# Altium schematic sheet Memory.SchDoc: SRAM & FLASH & SDRAM
size A4; DocumentNumber: MB1246; Revision: B.1; SheetNumber: 4; SheetTotal: 17; Project: STM32H7xxI-EVAL
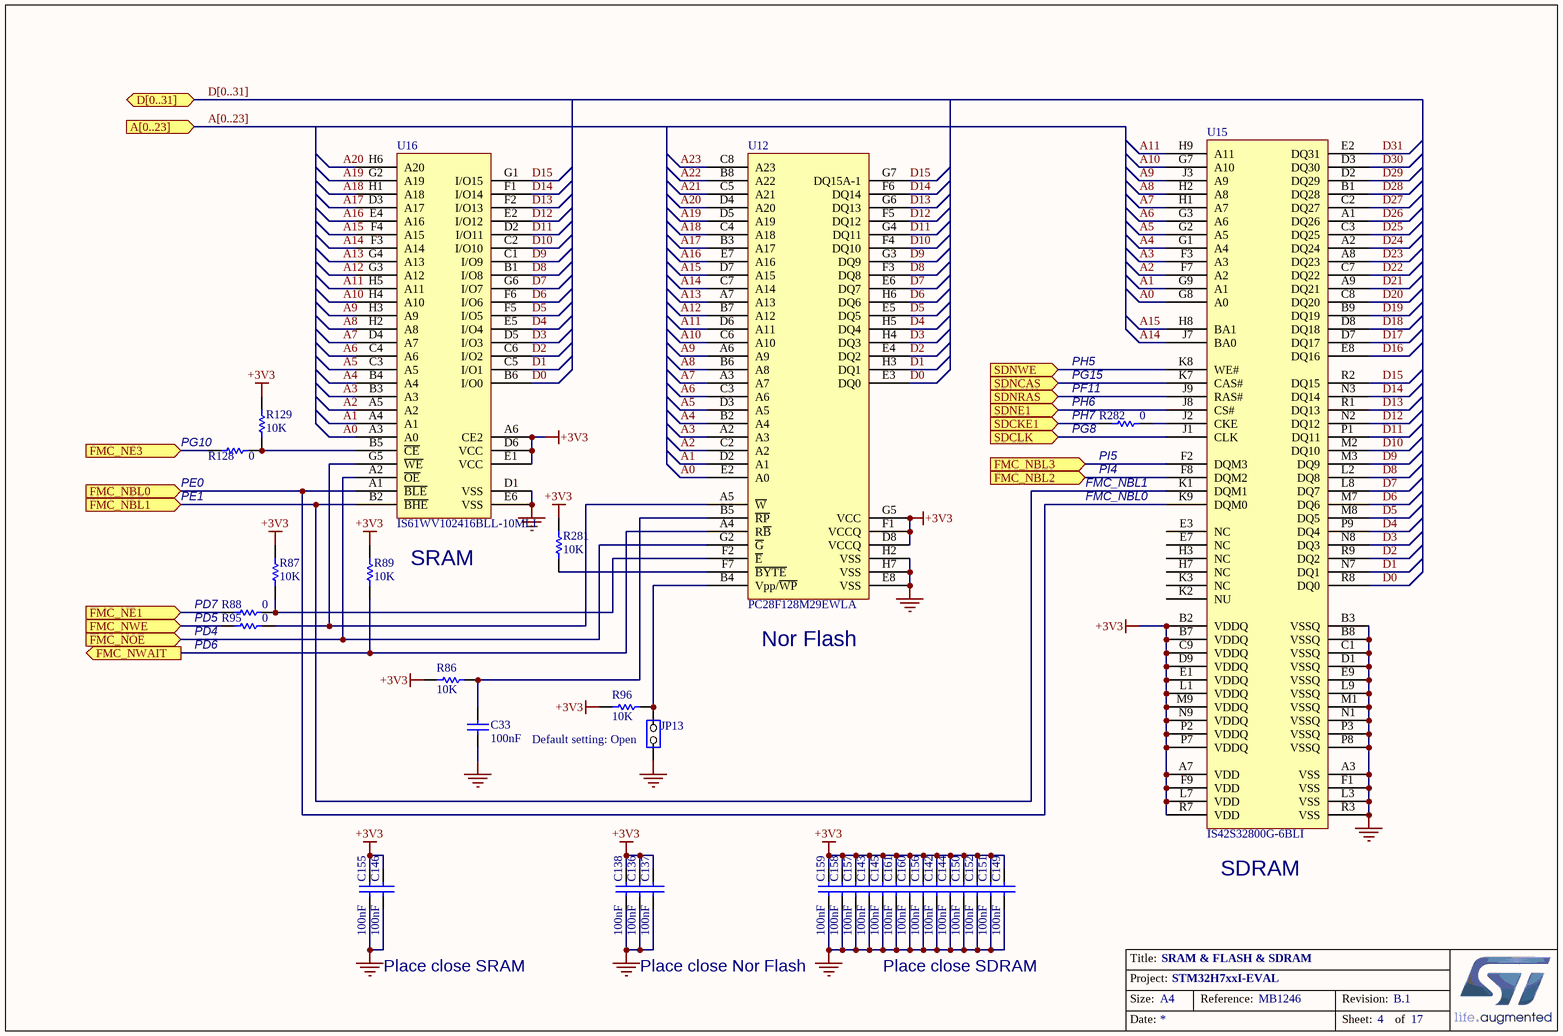
[diagram p0: Memory.SchDoc]

## Parts
C33  100nF  [0603C]
C136  100nF  [0603C]
C137  100nF  [0603C]
C138  100nF  [0603C]
C142  100nF  [0603C]
C143  100nF  [0603C]
C144  100nF  [0603C]
C145  100nF  [0603C]
C146  100nF  [0603C]
C149  100nF  [0603C]
C150  100nF  [0603C]
C151  100nF  [0603C]
C152  100nF  [0603C]
C155  100nF  [0603C]
C156  100nF  [0603C]
C157  100nF  [0603C]
C158  100nF  [0603C]
C159  100nF  [0603C]
C160  100nF  [0603C]
C161  100nF  [0603C]
JP13  (no value)  [SIP2]
R86  10K  [0603R]
R87  10K  [0603R]
R88  0  [0603R]
R89  10K  [0603R]
R95  0  [0603R]
R96  10K  [0603R]
R128  0  [0603R]
R129  10K  [0603R]
R281  10K  [0603R]
R282  0  [0603R]
U12  PC28F128M29EWLA  [FBGA64_1_11X13]
U15  IS42S32800G-6BLI  [FBGA90_0R8_8X13]
U16  IS61WV102416BLL-10MLI  [BGA48_0R75_9X11]

## Ports
A[0..23] (in), D[0..31] (bidir), FMC_NBL0 (in), FMC_NBL1 (in), FMC_NBL2 (in), FMC_NBL3 (in), FMC_NE1 (in), FMC_NE3 (in), FMC_NOE (in), FMC_NWAIT (out), FMC_NWE (in), SDCKE1 (in), SDCLK (in), SDNCAS (in), SDNE1 (in), SDNRAS (in), SDNWE (in)

## Nets
+3V3: C136.1 C137.1 C138.1 C142.1 C143.1 C144.1 C145.1 C146.1 C149.1 C150.1 C151.1 C152.1 C155.1 C156.1 C157.1 C158.1 C159.1 C160.1 C161.1 R86.1 R87.2 R89.2 R96.2 R129.2 R281.2 U12.D8(VCCQ) U12.F1(VCCQ) U12.G5(VCC) U15.A7(VDD) U15.B2(VDDQ) U15.B7(VDDQ) U15.C9(VDDQ) U15.D9(VDDQ) U15.E1(VDDQ) U15.F9(VDD) U15.L1(VDDQ) U15.L7(VDD) U15.M9(VDDQ) U15.N9(VDDQ) U15.P2(VDDQ) U15.P7(VDDQ) U15.R7(VDD) U16.A6(CE2) U16.D6(VCC) U16.E1(VCC)
GND: C33.2 C136.2 C137.2 C138.2 C142.2 C143.2 C144.2 C145.2 C146.2 C149.2 C150.2 C151.2 C152.2 C155.2 C156.2 C157.2 C158.2 C159.2 C160.2 C161.2 JP13.1(COMMON) U12.E8(VSS) U12.H2(VSS) U12.H7(VSS) U15.A3(VSS) U15.B3(VSSQ) U15.B8(VSSQ) U15.C1(VSSQ) U15.D1(VSSQ) U15.E9(VSSQ) U15.F1(VSS) U15.L3(VSS) U15.L9(VSSQ) U15.M1(VSSQ) U15.N1(VSSQ) U15.P3(VSSQ) U15.P8(VSSQ) U15.R3(VSS) U16.D1(VSS) U16.E6(VSS)
A0: U12.E2(A0) U15.G8(A0) U16.A3(A0)
A1: U12.D2(A1) U15.G9(A1) U16.A4(A1)
A2: U12.C2(A2) U15.F7(A2) U16.A5(A2)
A3: U12.A2(A3) U15.F3(A3) U16.B3(A3)
A4: U12.B2(A4) U15.G1(A4) U16.B4(A4)
A5: U12.D3(A5) U15.G2(A5) U16.C3(A5)
A6: U12.C3(A6) U15.G3(A6) U16.C4(A6)
A7: U12.A3(A7) U15.H1(A7) U16.D4(A7)
A8: U12.B6(A8) U15.H2(A8) U16.H2(A8)
A9: U12.A6(A9) U15.J3(A9) U16.H3(A9)
A10: U12.C6(A10) U15.G7(A10) U16.H4(A10)
A11: U12.D6(A11) U15.H9(A11) U16.H5(A11)
A12: U12.B7(A12) U16.G3(A12)
A13: U12.A7(A13) U16.G4(A13)
A14: U12.C7(A14) U15.J7(BA0) U16.F3(A14)
A15: U12.D7(A15) U15.H8(BA1) U16.F4(A15)
A16: U12.E7(A16) U16.E4(A16)
A17: U12.B3(A17) U16.D3(A17)
A18: U12.C4(A18) U16.H1(A18)
A19: U12.D5(A19) U16.G2(A19)
A20: U12.D4(A20) U16.H6(A20)
A21: U12.C5(A21)
A22: U12.B8(A22)
A23: U12.C8(A23)
D0: U12.E3(DQ0) U15.R8(DQ0) U16.B6(I/O0)
D1: U12.H3(DQ1) U15.N7(DQ1) U16.C5(I/O1)
D2: U12.E4(DQ2) U15.R9(DQ2) U16.C6(I/O2)
D3: U12.H4(DQ3) U15.N8(DQ3) U16.D5(I/O3)
D4: U12.H5(DQ4) U15.P9(DQ4) U16.E5(I/O4)
D5: U12.E5(DQ5) U15.M8(DQ5) U16.F5(I/O5)
D6: U12.H6(DQ6) U15.M7(DQ6) U16.F6(I/O6)
D7: U12.E6(DQ7) U15.L8(DQ7) U16.G6(I/O7)
D8: U12.F3(DQ8) U15.L2(DQ8) U16.B1(I/O8)
D9: U12.G3(DQ9) U15.M3(DQ9) U16.C1(I/O9)
D10: U12.F4(DQ10) U15.M2(DQ10) U16.C2(I/O10)
D11: U12.G4(DQ11) U15.P1(DQ11) U16.D2(I/O11)
D12: U12.F5(DQ12) U15.N2(DQ12) U16.E2(I/O12)
D13: U12.G6(DQ13) U15.R1(DQ13) U16.F2(I/O13)
D14: U12.F6(DQ14) U15.N3(DQ14) U16.F1(I/O14)
D15: U12.G7(DQ15A-1) U15.R2(DQ15) U16.G1(I/O15)
D16: U15.E8(DQ16)
D17: U15.D7(DQ17)
D18: U15.D8(DQ18)
D19: U15.B9(DQ19)
D20: U15.C8(DQ20)
D21: U15.A9(DQ21)
D22: U15.C7(DQ22)
D23: U15.A8(DQ23)
D24: U15.A2(DQ24)
D25: U15.C3(DQ25)
D26: U15.A1(DQ26)
D27: U15.C2(DQ27)
D28: U15.B1(DQ28)
D29: U15.D2(DQ29)
D30: U15.D3(DQ30)
D31: U15.E2(DQ31)
FMC_NBL0: U15.K9(DQM0) U16.A1(~{BLE}) ; port FMC_NBL0
FMC_NBL1: U15.K1(DQM1) U16.B2(~{BHE}) ; port FMC_NBL1
FMC_NBL2: U15.F8(DQM2) ; port FMC_NBL2
FMC_NBL3: U15.F2(DQM3) ; port FMC_NBL3
FMC_NE1: R88.2 ; port FMC_NE1
FMC_NE3: R128.2 ; port FMC_NE3
FMC_NOE: U12.G2(~{G}) U16.A2(~{OE}) ; port FMC_NOE
FMC_NWAIT: R89.1 U12.A4(R~{B}) ; port FMC_NWAIT
FMC_NWE: R95.2 ; port FMC_NWE
SDCKE1: R282.2 ; port SDCKE1
SDCLK: U15.J1(CLK) ; port SDCLK
SDNCAS: U15.K7(CAS#) ; port SDNCAS
SDNE1: U15.J8(CS#) ; port SDNE1
SDNRAS: U15.J9(RAS#) ; port SDNRAS
SDNWE: U15.K8(WE#) ; port SDNWE
NetC33_1: C33.1 R86.2 U12.B5(~{RP})
NetJP13_2: JP13.2(NO) R96.1 U12.B4(Vpp/~{WP})
NetR87_1: R87.1 R88.1 U12.F2(~{E})
NetR95_1: R95.1 U12.A5(~{W}) U16.G5(~{WE})
NetR128_1: R128.1 R129.1 U16.B5(~{CE})
NetR281_1: R281.1 U12.F7(~{BYTE})
NetR282_1: R282.1 U15.J2(CKE)

Not connected (* = marked no-connect by the designer): U15 E3(NC) E7(NC) H3(NC) H7(NC) K2(NU) K3(NC)

## Buses and harness runs
bus A[0..23] = port A[0..23]
bus D[0..31] = port D[0..31]

## Notes on the sheet
- PH5
- (near R282) PG15
- (near R128) PG10
- (near R282) PF11
- (near R282) PH6
- (near R282) PH7
- (near R282) PG8
- (near R128) PE1
- (near R128) PE0
- FMC_NBL1
- FMC_NBL0
- (near R282) PI5
- (near R282) PI4
- SRAM
- PD5
- PD7
- PD6
- PD4
- (near U12) Nor Flash
- (near JP13) Default setting: Open
- (near U15) SDRAM
- Place close SRAM
- Place close Nor Flash
- Place close SDRAM
- Title:
- Project:
- Size:
- Date:
- A4
- Reference:
- Sheet:
- Revision:
- of

## Library data of the parts
C33 C136-C138 C142-C146 C149-C152 C155-C161 = Cap: Capacitor; Value: 10nF; Published: 8-Jun-2000; Revision: July-2002: Re-released for DXP Platform.; Publisher: Altium Limited
JP13 = JP2
R86-R89 R95 R96 R128 R129 R281 R282 = Res1: Resistor; Value: 1K; Published: 8-Jun-2000; Revision: July-2002: Re-released for DXP Platform.; Publisher: Altium Limited
U12 = M29W128FL70ZA6E
U15 = MT48LC4M32B2B5